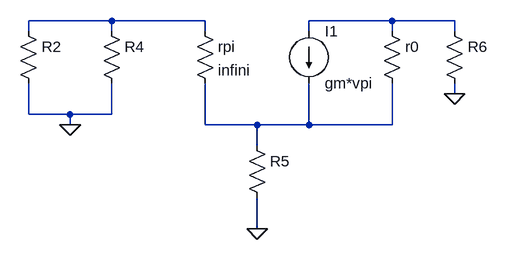
[diagram p0: schematic Draft1.asc]
Draft1.asc, the LTspice schematic file:
Version 4
SHEET 1 1076 680
WIRE 368 272 240 272
WIRE 512 272 368 272
WIRE 800 272 672 272
WIRE 896 272 800 272
WIRE 240 288 240 272
WIRE 368 288 368 272
WIRE 512 288 512 272
WIRE 672 288 672 272
WIRE 800 288 800 272
WIRE 896 288 896 272
WIRE 896 384 896 368
WIRE 240 416 240 368
WIRE 304 416 240 416
WIRE 368 416 368 368
WIRE 368 416 304 416
WIRE 304 432 304 416
WIRE 512 432 512 368
WIRE 592 432 512 432
WIRE 672 432 672 368
WIRE 672 432 592 432
WIRE 800 432 672 432
WIRE 800 432 800 368
WIRE 592 464 592 432
WIRE 592 592 592 544
FLAG 592 592 0
FLAG 304 432 0
FLAG 896 384 0
SYMBOL Res 224 272 R0
SYMATTR InstName R2
SYMATTR Value ""
SYMBOL Res 352 272 R0
SYMATTR InstName R4
SYMATTR Value ""
SYMBOL Res 496 272 R0
SYMATTR InstName rpi
SYMATTR Value infini
SYMBOL Res 576 448 R0
SYMATTR InstName R5
SYMATTR Value ""
SYMBOL Res 784 272 R0
SYMATTR InstName r0
SYMATTR Value ""
SYMBOL Res 880 272 R0
SYMATTR InstName R6
SYMATTR Value ""
SYMBOL current 672 288 R0
SYMATTR InstName I1
SYMATTR Value gm*vpi

The netlist it stands for:
* Draft1.asc
R2 N001 0
R4 N001 0
rpi N001 N003 infini
R5 N003 0
r0 N002 N003
R6 N002 0
I1 N002 N003 gm*vpi
.backanno
.end